# Altium schematic sheet Peripherals.SchDoc
size A4; Revision: D.1(PCB.SCH)
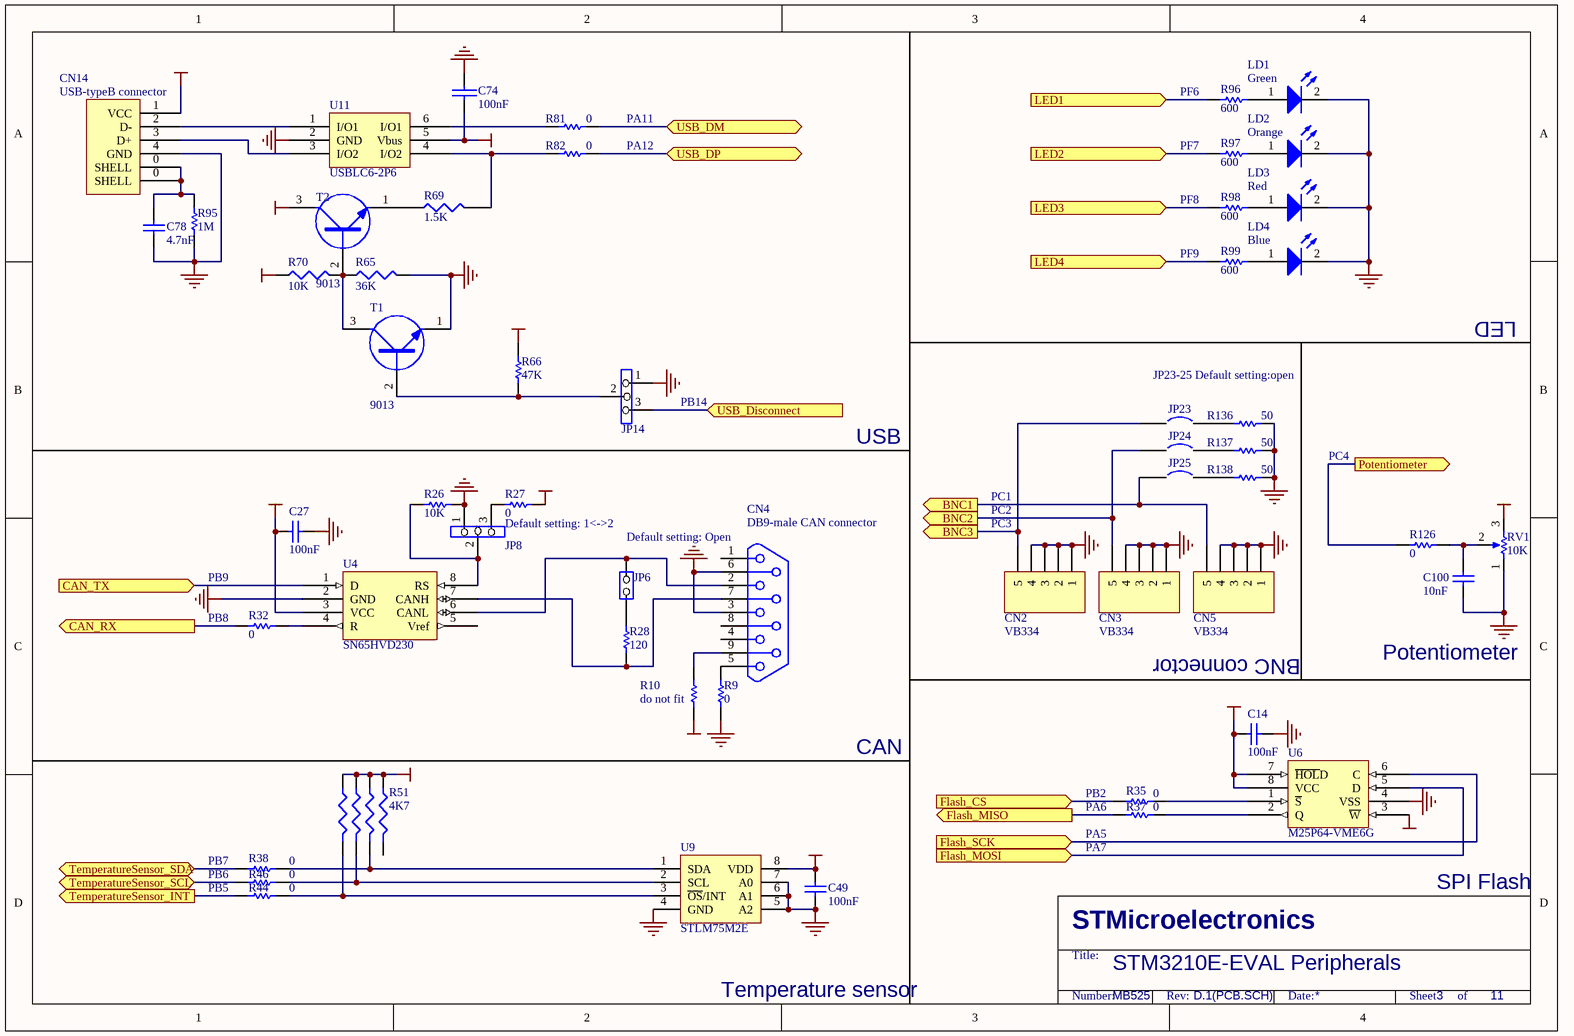
[diagram p0: Peripherals.SchDoc]

## Parts
C14  100nF  [0603P]
C27  100nF  [0603P]
C49  100nF  [0603P]
C74  100nF  [0603P]
C78  4.7nF  [0603]
C100  10nF  [0603]
CN2  VB334  [VB334]
CN3  VB334  [VB334]
CN4  DB9-male CAN connector  [DB9/M]
CN5  VB334  [VB334]
CN14  USB-typeB connector  [USB-B]
JP6  (no value)  [SIP2]
JP8  (no value)  [SIP3]
JP14  (no value)  [SIP3]
JP23  (no value)  [SPST-2]
JP24  (no value)  [SPST-2]
JP25  (no value)  [SPST-2]
LD1  Green  [D0603]
LD2  Orange  [D0603]
LD3  Red  [D0603]
LD4  Blue  [D0603]
R9  0  [0603]
R10  do not fit  [0603]
R26  10K  [0603]
R27  0  [0603]
R28  120  [0603]
R32  0  [0805]
R35  0  [0805]
R37  0  [0805]
R38  0  [0805]
R44  0  [0805]
R46  0  [0805]
R51  4K7  [RES4B]
R65  36K  [0603]
R66  47K  [0603]
R69  1.5K  [0603]
R70  10K  [0603]
R81  0  [0603]
R82  0  [0603]
R95  1M  [0603]
R96  600  [0805]
R97  600  [0805]
R98  600  [0805]
R99  600  [0805]
R126  0  [0805]
R136  50  [0603]
R137  50  [0603]
R138  50  [0603]
RV1  10K  [ADJRH]
T1  9013  [SOT-23]
T2  9013  [SOT-23]
U4  SN65HVD230  [SO8]
U6  M25P64-VME6G  [VDFPN8(8*6)]
U9  STLM75M2E  [SO8]
U11  USBLC6-2P6  [SOT-666]

## Ports
BNC1 (out), BNC2 (out), BNC3 (out), CAN_RX (out), CAN_TX (in), Flash_CS (in), Flash_MISO (out), Flash_MOSI (in), Flash_SCK (in), LED1 (in), LED2 (in), LED3 (in), LED4 (in), Potentiometer (out), TemperatureSensor_INT (out), TemperatureSensor_SCL (bidir), TemperatureSensor_SDA (bidir), USB_Disconnect (in), USB_DM (bidir), USB_DP (bidir)

## Nets
+3V3: C14.2 C27.2 C49.2 R10.1 R27.2 R51.1(R0) R51.3(R2) R51.5(R3) R51.7(R1) R66.2 RV1.3(TOP) T2.3(C) U4.3(VCC) U6.3(~{W}) U6.7(~{HOL}D) U6.8(VCC) U9.8(VDD)
GND: C14.1 C27.1 C49.1 C74.1 C78.1 C100.1 CN2.1 CN2.2 CN2.3 CN2.4 CN3.1 CN3.2 CN3.3 CN3.4 CN4.3 CN4.6 CN5.1 CN5.2 CN5.3 CN5.4 CN14.4(GND) JP8.1 JP14.1 LD1.2(K) LD2.2(K) LD3.2(K) LD4.2(K) R9.1 R26.2 R65.2 R95.1 R136.2 R137.2 R138.2 RV1.1(BOT) T1.1(E) U4.2(GND) U6.4(VSS) U9.4(GND) U9.5(A2) U9.6(A1) U9.7(A0) U11.2(GND)
U5V: C74.2 CN14.1(VCC) R70.1 U11.5(Vbus)
BNC1: CN5.5 JP25.1 ; port BNC1
BNC2: CN3.5 JP24.1 ; port BNC2
BNC3: CN2.5 JP23.1 ; port BNC3
CAN_RX: R32.2 ; port CAN_RX
CAN_TX: U4.1(D) ; port CAN_TX
Flash_CS: R35.2 ; port Flash_CS
Flash_MISO: R37.1 ; port Flash_MISO
Flash_MOSI: U6.5(D) ; port Flash_MOSI
Flash_SCK: U6.6(C) ; port Flash_SCK
LED1: R96.2 ; port LED1
LED2: R97.2 ; port LED2
LED3: R98.2 ; port LED3
LED4: R99.2 ; port LED4
Potentiometer: R126.1 ; port Potentiometer
TemperatureSensor_INT: R46.2 ; port TemperatureSensor_INT
TemperatureSensor_SCL: R44.2 ; port TemperatureSensor_SCL
TemperatureSensor_SDA: R38.2 ; port TemperatureSensor_SDA
USB_Disconnect: JP14.3 ; port USB_Disconnect
USB_DM: R81.1 ; port USB_DM
USB_DP: R82.1 ; port USB_DP
NetC78_2: C78.2 CN14.0(SHELL) R95.2
NetC100_2: C100.2 R126.2 RV1.2(TAP)
NetCN4_2: CN4.2 JP6.2(NO) U4.6(CANL)
NetCN4_5: CN4.5 R9.2
NetCN4_7: CN4.7 R28.1 U4.7(CANH)
NetCN4_9: CN4.9 R10.2
NetCN14_2: CN14.2(D-) U11.1(I/O1)
NetCN14_3: CN14.3(D+) U11.3(I/O2)
NetJP6_1: JP6.1(COMMON) R28.2
NetJP8_2: JP8.2 R26.1 U4.8(RS)
NetJP8_3: JP8.3 R27.1
NetJP14_2: JP14.2 R66.1 T1.2(B)
NetJP23_2: JP23.2 R136.1
NetJP24_2: JP24.2 R137.1
NetJP25_2: JP25.2 R138.1
NetLD1_1: LD1.1(A) R96.1
NetLD2_1: LD2.1(A) R97.1
NetLD3_1: LD3.1(A) R98.1
NetLD4_1: LD4.1(A) R99.1
NetR32_1: R32.1 U4.4(R)
NetR35_1: R35.1 U6.1(~{S})
NetR37_2: R37.2 U6.2(Q)
NetR38_1: R38.1 R51.4(R3) U9.1(SDA)
NetR44_1: R44.1 R51.6(R2) U9.2(SCL)
NetR46_1: R46.1 R51.8(R0) U9.3(~{OS}/INT)
NetR65_1: R65.1 R70.2 T1.3(C) T2.2(B)
NetR69_1: R69.1 T2.1(E)
NetR69_2: R69.2 R82.2 U11.4(I/O2)
NetR81_2: R81.2 U11.6(I/O1)

Not connected (* = marked no-connect by the designer): CN4 1 4 8; R51 2(R1); U4 5(Vref)

## Notes on the sheet
- (near R96) PF6
- PA12
- PA11
- (near R97) PF7
- (near R98) PF8
- (near R99) PF9
- LED
- JP23-25 Default setting:open
- (near JP14) PB14
- USB
- PC2
- PC1
- PC4
- (near R32) PB9
- Default setting: 1<->2
- (near CN4) Default setting: Open
- (near CN2) PC3
- (near R32) PB8
- BNC connector
- Potentiometer
- CAN
- PB2
- PA6
- PA5
- PA7
- PB6
- PB7
- PB5
- SPI Flash
- STM3210E-EVAL Peripherals
- Temperature sensor
- MB525
- 3
- 11
- STMicroelectronics
- Title:
- Number:
- Rev:
- Date:
- Sheet       of

## Library data of the parts
C14 C27 C74 = CAP: Capacitor
  C14 C27: Published: 8-Jun-2000; Revision: July-2002: Re-released for DXP Platform.; Publisher: Altium Limited; Value: 100nF
C49 = cap: Capacitor; Value: 100pF; Published: 8-Jun-2000; Revision: July-2002: Re-released for DXP Platform.; Publisher: Altium Limited
C78 C100 = CAP: Capacitor; Value: 100pF; Published: 8-Jun-2000; Revision: July-2002: Re-released for DXP Platform.; Publisher: Altium Limited
CN2 CN3 CN5 = Header 5: Header, 5-Pin; Revision: 17-Jul-2002: Re-released for DXP Platform.; Publisher: Altium Limited
CN4 = DB9
CN14 = USB-B
JP6 = JP2
JP8 JP14 = Jumper3
JP23-JP25 = Circuit Breaker: Published: 24-Mar-1999; Revision: July-2002: Re-released for DXP Platform.; Publisher: Altium Limited
LD1-LD4 = LED2: Typical RED, GREEN, YELLOW, AMBER GaAs LED; Published: 8-Jun-2000; Revision: July-2002: Re-released for DXP Platform.; Publisher: Altium Limited
R9 R10 R26-R28 = res1: Resistor; Value: 1K; Published: 8-Jun-2000; Revision: July-2002: Re-released for DXP Platform.; Publisher: Altium Limited
R32 R35 R37 R38 R44 R46 R66 R81 R82 R95-R99 R126 R136-R138 = Res1: Resistor; Value: 1K; Published: 8-Jun-2000; Revision: July-2002: Re-released for DXP Platform.; Publisher: Altium Limited
R51 = RES4B
R65 R70 = R: Right: 20; Bottom: 30
R69 = RES1
RV1 = RV
T1 T2 = NPN
U4 = SN65HVD230D
U9 = STLM75DW2F
U11 = USBLC6-2